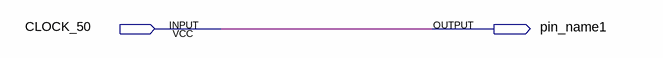
[diagram p0: schematic sheet]
// Quartus schematic schema.bdf as structural Verilog: 0 symbols, 2 pins
module schema (
  input  CLOCK_50,
  output pin_name1
);


  assign pin_name1 = CLOCK_50;
endmodule
